# EAGLE design opi0-plus (EAGLE 9.2.1)
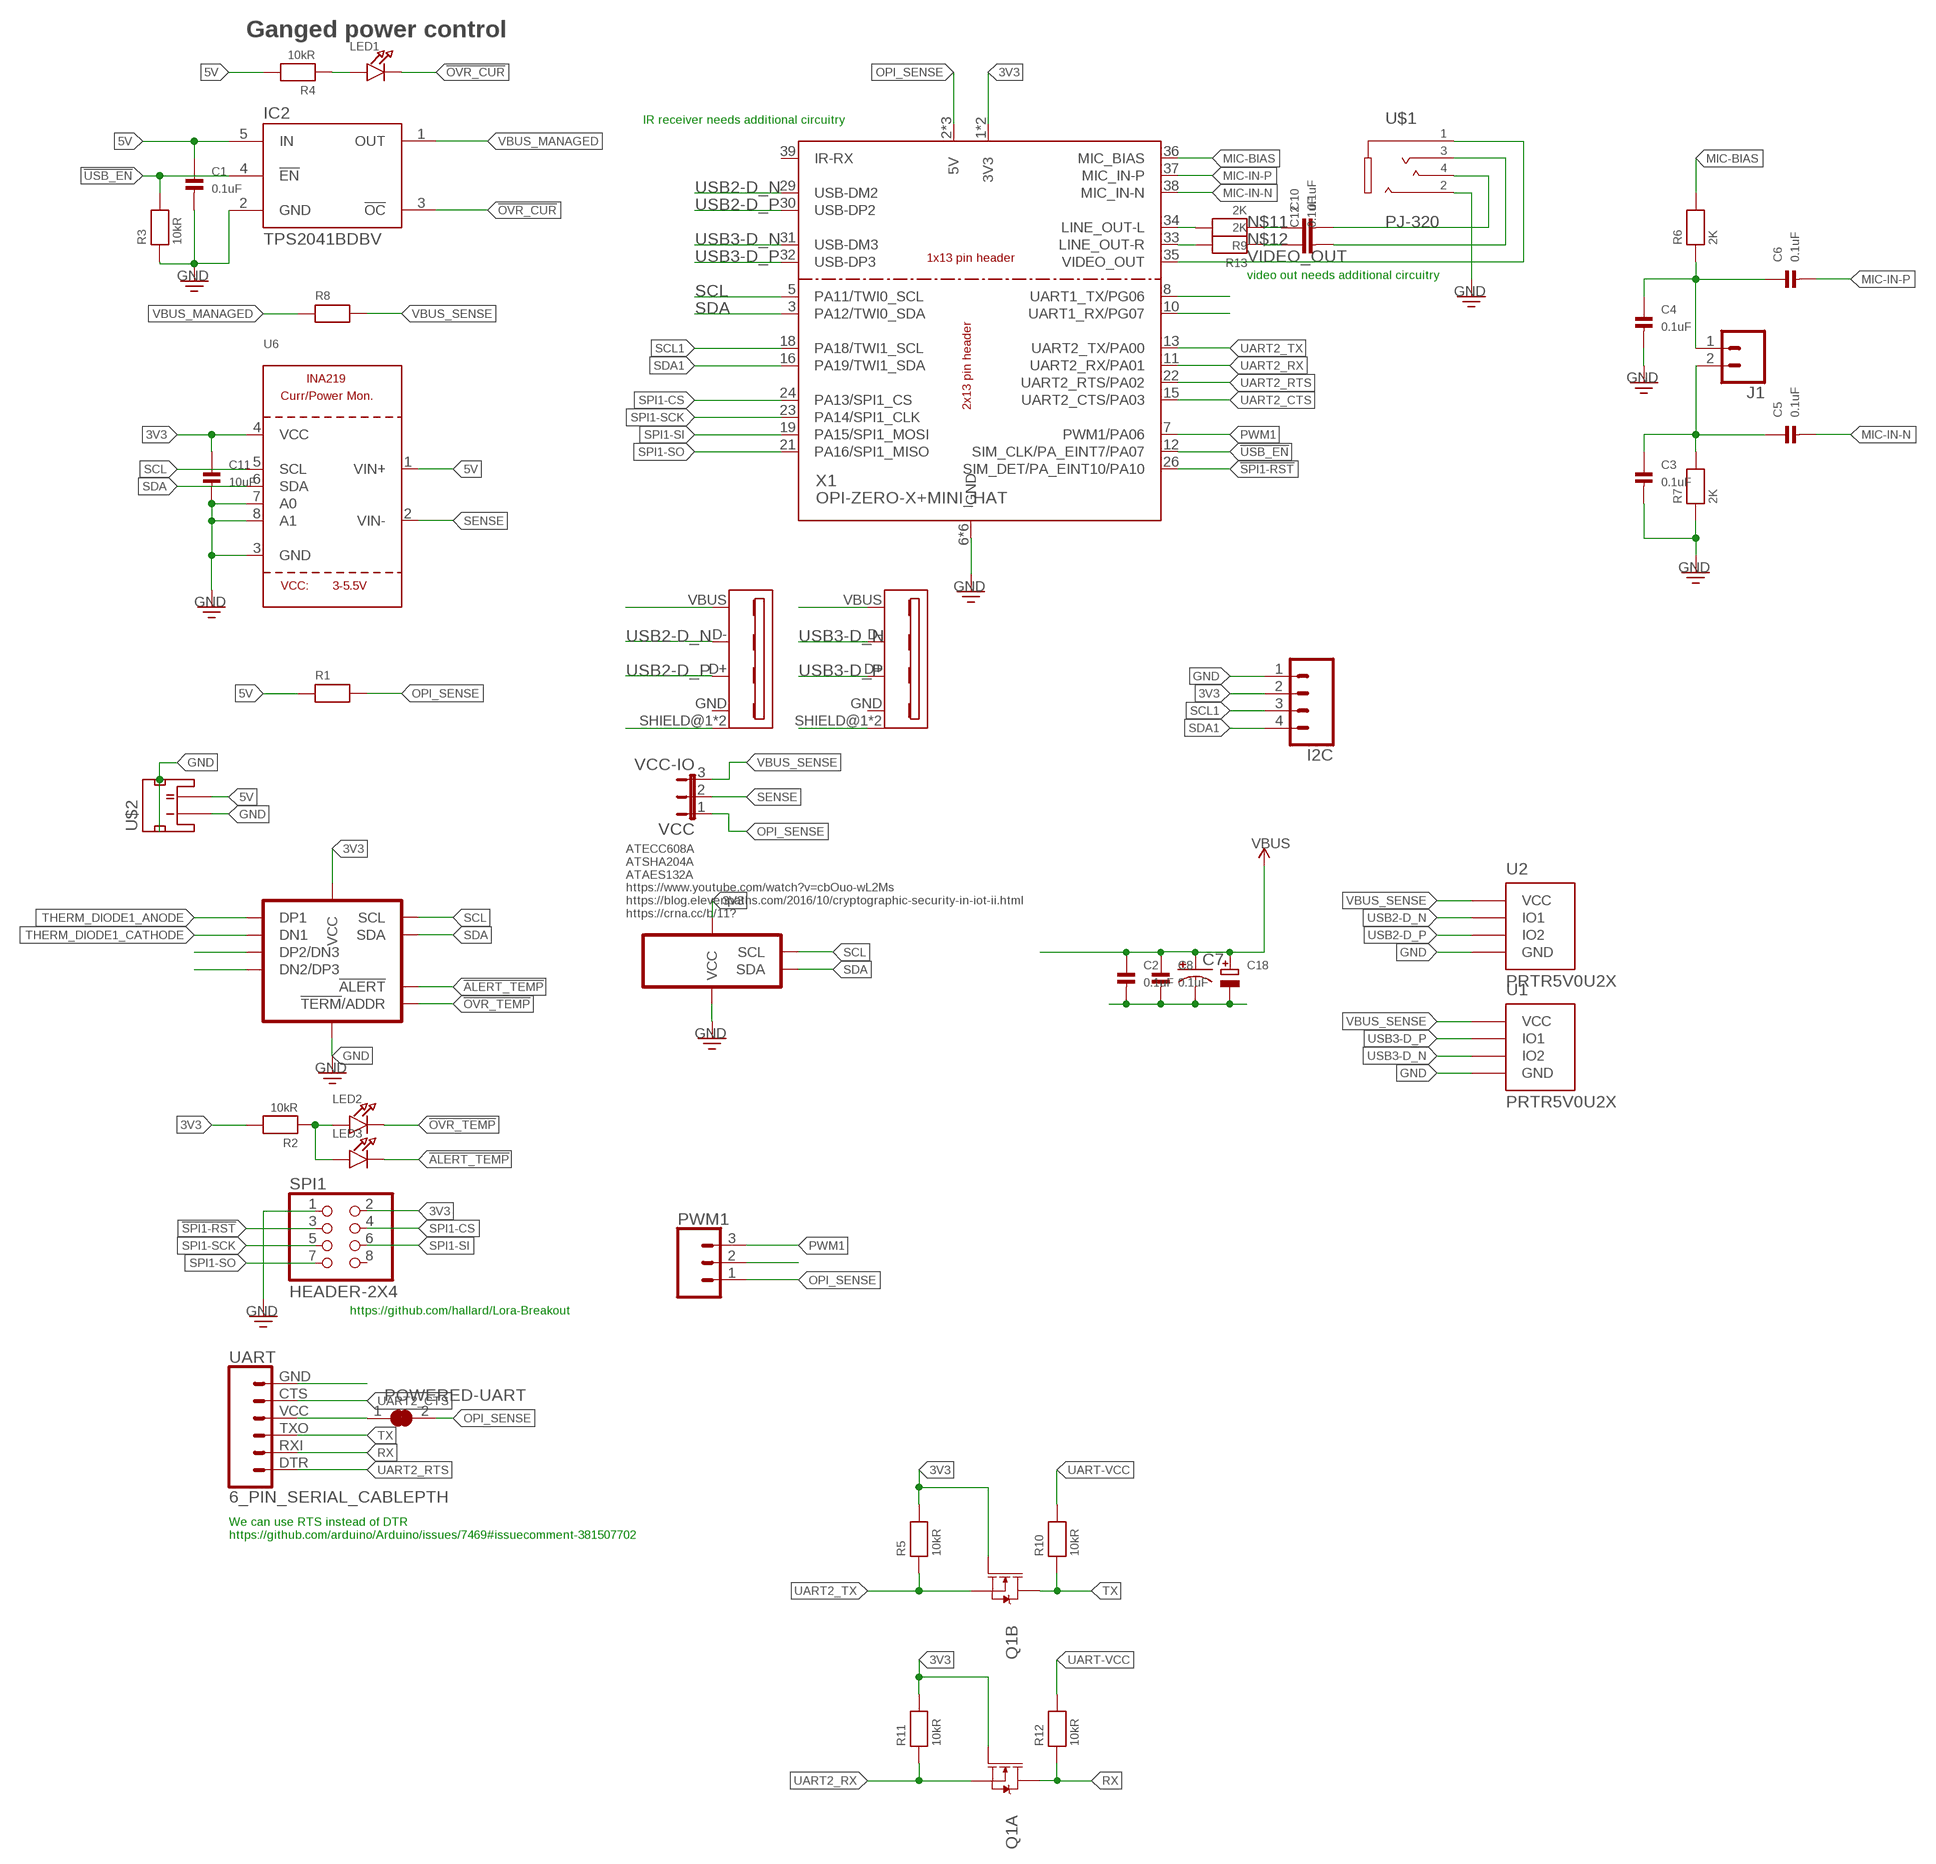
[diagram p0: schematic, sheet 1]

## Parts
C1  0.1uF  CAP_CERAMIC_0603MP  [_0603MP]
C2  0.1uF  CAP_CERAMIC_0603MP  [_0603MP]
C3  0.1uF  CAP_CERAMIC_0603MP  [_0603MP]
C4  0.1uF  CAP_CERAMIC_0603MP  [_0603MP]
C5  0.1uF  CAP_CERAMIC_0603MP  [_0603MP]
C6  0.1uF  CAP_CERAMIC_0603MP  [_0603MP]
C7  CAP_POLD  [PANASONIC_D]
C8  0.1uF  CAP_CERAMIC_0603MP  [_0603MP]
C10  0.1uF  CAP_CERAMIC_0603MP  [_0603MP]
C11  10uF  CAP_CERAMIC_0603MP  [_0603MP]
C12  0.1uF  CAP_CERAMIC_0603MP  [_0603MP]
C18  CAP_ELECTROLYTICPTH_3.5MMGRID_8MMDIA  [CELEC_3.5MM_8MM]
I2C  CONN_04  [1X04]
IC2  TPS2041BDBV  [SOT23-5L]
J1  CONN_02  [1X02]
LED1  LED0603_NOOUTLINE  [CHIPLED_0603_NOOUTLINE]
LED2  LED0603_NOOUTLINE  [CHIPLED_0603_NOOUTLINE]
LED3  LED0603_NOOUTLINE  [CHIPLED_0603_NOOUTLINE]
POWERED-UART  SOLDERJUMPER_CLOSED  [SOLDERJUMPER_CLOSEDWIRE]
PWM1  CONN_03JST-PTH-VERT  [JST-3-PTH-VERT]
Q1  MOSFET_NCH_DUAL-IRF5852  [SOT23-6]
R1  RESISTOR1206  [1206]
R2  10kR  RESISTOR_0603MP  [_0603MP]
R3  10kR  RESISTOR_0603MP  [_0603MP]
R4  10kR  RESISTOR_0603MP  [_0603MP]
R5  10kR  RESISTOR_0603MP  [_0603MP]
R6  2K  RESISTOR_0603MP  [_0603MP]
R7  2K  RESISTOR_0603MP  [_0603MP]
R8  RESISTOR1206  [1206]
R9  2K  RESISTOR_0603MP  [_0603MP]
R10  10kR  RESISTOR_0603MP  [_0603MP]
R11  10kR  RESISTOR_0603MP  [_0603MP]
R12  10kR  RESISTOR_0603MP  [_0603MP]
R13  2K  RESISTOR_0603MP  [_0603MP]
SPI1  HEADER-2X4  [2X04]
U1  PRTR5V0U2X  [SOT-143B]
U2  PRTR5V0U2X  [SOT-143B]
U6  INA219  [SOT23-8]
U$1  PJ-320  [PJ-320]
U$2  JST-PH-2P  [JST-PH-SMD]
U$3  MCP9904  [VDFN-10-0.5-3X3]
U$5  ATECC508A-MAH  [UDFN-8-0.5-3X2]
UART  6_PIN_SERIAL_CABLEPTH  [FTDI_BASIC]
USB1  USB-A-FA-F-PTH  [USB-A-F-PTH]
USB2  USB-A-FA-F-PTH  [USB-A-F-PTH]
VCC  VCC-IO  JUMPER3  [JUMPER3]
X1  OPI-ZERO-X+MINI_HAT  [OPI0+MINI_HAT]

## Nets
3V3: C11.1 I2C.2 Q1.1(A:G) Q1.3(B:G) R2.2 R5.2 R11.2 SPI1.2 U6.4(VCC) U$3.P1(VCC) U$5.P8(VCC) X1.1(3V3) X1.17(3V3)
5V: C1.1 IC2.5(IN) R1.1 R4.2 U6.1(VIN+) U$2.2
!ALERT_TEMP: LED3.C U$3.P8(!ALERT)
!OVR_CUR: IC2.3(!OC) LED1.C
!OVR_TEMP: LED2.C U$3.P7(!TERM!/ADDR)
!SPI1-RST!: SPI1.3 X1.26(SIM_DET/PA_EINT10/PA10)
!USB_EN: IC2.4(!EN) R3.2 X1.12(SIM_CLK/PA_EINT7/PA07)
GND: C1.2 C2.2 C3.2 C4.2 C7.- C8.2 C11.2 C18.- I2C.1 IC2.2(GND) PWM1.2 R3.1 R7.1 SPI1.1 U1.1(GND) U2.1(GND) U6.3(GND) U6.7(A0) U6.8(A1) U$1.2_1 U$2.1 U$2.SOL@1(PAD1) U$2.SOL@2(PAD2) U$3.P6(GND) U$5.P4(GND) UART.GND USB1.SHIELD@1(SHIELD) USB1.SHIELD@2(SHIELD) USB2.SHIELD@1(SHIELD) USB2.SHIELD@2(SHIELD) X1.6(GND) X1.9(GND) X1.14(GND) X1.20(GND) X1.25(GND) X1.28(GND)
LINE-L: C10.2 U$1.4_1
LINE-R: C12.2 U$1.3
MIC-BIAS: R6.2 X1.36(MIC_BIAS)
MIC-IN-N: C5.2 X1.38(MIC_IN-N)
MIC-IN-P: C6.2 X1.37(MIC_IN-P)
N$1: X1.8(UART1_TX/PG06)
N$2: LED2.A LED3.A R2.1
N$3: X1.10(UART1_RX/PG07)
N$4: C4.1 C6.1 J1.1 R6.1
N$5: C3.1 C5.1 J1.2 R7.2
N$6: U$3.P4(DP2/DN3)
N$7: LED1.A R4.1
N$8: R9.2 X1.34(LINE_OUT-L)
N$9: U$3.P5(DN2/DP3)
N$10: R13.2 X1.33(LINE_OUT-R)
N$11: C10.1 R9.1
N$12: C12.1 R13.1
OPI_SENSE: POWERED-UART.2 PWM1.1 R1.2 VCC.1 X1.2(5V) X1.4(5V) X1.27(5V)
PWM1: PWM1.3 X1.7(PWM1/PA06)
RX: Q1.6(A:D) R12.1 UART.RXI
SCL: U6.5(SCL) U$3.P10(SCL) U$5.P6(SCL) X1.5(PA11/TWI0_SCL)
SCL1: I2C.3 X1.18(PA18/TWI1_SCL)
SDA: U6.6(SDA) U$3.P9(SDA) U$5.P5(SDA) X1.3(PA12/TWI0_SDA)
SDA1: I2C.4 X1.16(PA19/TWI1_SDA)
SENSE: U6.2(VIN-) VCC.2
SPI1-CS: SPI1.4 X1.24(PA13/SPI1_CS)
SPI1-SCK: SPI1.5 X1.23(PA14/SPI1_CLK)
SPI1-SI: SPI1.6 X1.19(PA15/SPI1_MOSI)
SPI1-SO: SPI1.7 X1.21(PA16/SPI1_MISO)
THERM_DIODE1_ANODE: U$3.P2(DP1)
THERM_DIODE1_CATHODE: U$3.P3(DN1)
TX: Q1.4(B:D) R10.1 UART.TXO
UART2_CTS: UART.CTS X1.15(UART2_CTS/PA03)
UART2_RTS: UART.DTR X1.22(UART2_RTS/PA02)
UART2_RX: Q1.5(A:S) R11.1 X1.11(UART2_RX/PA01)
UART2_TX: Q1.2(B:S) R5.1 X1.13(UART2_TX/PA00)
UART-VCC: POWERED-UART.1 R10.2 R12.2 UART.VCC
USB2-D_N: U2.2(IO1) USB1.D- X1.29(USB-DM2)
USB2-D_P: U2.3(IO2) USB1.D+ X1.30(USB-DP2)
USB3-D_N: U1.3(IO2) USB2.D- X1.31(USB-DM3)
USB3-D_P: U1.2(IO1) USB2.D+ X1.32(USB-DP3)
VBUS_MANAGED: IC2.1(OUT) R8.1
VBUS_SENSE: C2.1 C7.+ C8.1 C18.+ R8.2 U1.4(VCC) U2.4(VCC) USB1.VBUS USB2.VBUS VCC.3
VIDEO_OUT: U$1.1 X1.35(VIDEO_OUT)
Unconnected: SPI1.8 X1.39(IR-RX)

## Notes on the sheet
- Ganged power control
- IR receiver needs additional circuitry
- video out needs additional circuitry
- ATECC608A
  ATSHA204A
  ATAES132A
  https://www.youtube.com/watch?v=cbOuo-wL2Ms
  https://blog.elevenpaths.com/2016/10/cryptographic-security-in-iot-ii.html
  https://crna.cc/b/11?
- https://github.com/hallard/Lora-Breakout
- We can use RTS instead of DTR
  https://github.com/arduino/Arduino/issues/7469#issuecomment-381507702

## Power pins joined to a net without a drawn wire
GND: USB1.GND USB2.GND

## Library data of the parts
C1-C6 C8 C10-C12 = microbuilder:CAP_CERAMIC: Ceramic Capacitors 0402 - 0402 Surface Mount Capacitors 16pF 50V 5% [Digikey: 445-4899-2-ND] 18pF 50V 5% [Digikey: 490-1281-2-ND] 22pF 50V 5% [Digikey: 490-1283-2-ND] 68pF 50V 5% [Digikey: 490-1289-2-ND] 0.1uF 10V 10% [Digikey: 490-1318-2-ND] 1.0uF 6.3V 10% [Digikey: 490-1320-2-ND] 0603 - 0603 Surface Mount Capacitors 16 pF 50V 5% [Digikey: 445-5051-2-ND] 22 pF 50V [Digikey: PCC220ACVTR-ND] 33 pF 50V 5% [Digikey: 490-1415-1-ND] 56pF 50V 5% [Digikey: 490-1421-1-ND] 220pF 50V 5% [Digikey: 445-1285-1-ND] 680 pF 50V 2200 pF 50V 5% C0G [Digikey: 445-1297-1-ND] 5600 pF 100V 5% X7R [Digikey: 478-3711-1-ND] 0.1 µF 25V 10% [Digikey: PCC2277TR-ND] 0.22 µF 16V 10% X7R [Digikey: 445-1318-1-ND] 1.0 µF 25V 10% [Digikey: 445-5146-2-ND] 0603 - RF Specific 3pF 250V +/-0.1pF RF [Digikey: 712-1347-1-ND] 18 pF 250V 5% [Digikey: 478-3505-1-ND or 712-1322-1-ND] 56 pF 250V 5% C0G RF [Digikey: 490-4867-1-ND] 68 pF 250V RF [Digikey: 490-4868-1-ND] 0805 - 0805 Surface Mount Capacitors 220 pF 250V 2% RF Ceramic Capacitor [Digikey: 712-1398-1-ND] 1000 pF 50V 2% NP0 Ceramic Capacitor [Digikey: 478-3760-1-ND] 0.1 µF 25V 10% Ceramic Capacitor [Digikey: PCC1828TR-ND] 1.0 µF 16V 10% Ceramic Capacitor[Digikey: 490-1691-2-ND] 10.0 µF 10V 10% Ceramic Capacitor[Digikey: 709-1228-1-ND] 10.0 uF 16V 10% Ceramic Capacitor [Digikey: 478-5165-2-ND] 47 uF 6.3V 20% Ceramic Capacitor [Digikey: 587-1779-1-ND or 399-5506-1-ND] 1206 - 1206 Surface Mount Capacitors 47uF 10V 20% Ceramic Capacitor [Digikey: 490-5528-1-ND or 399-5508-1-ND or 445-6010-1-ND] 100uF 6.3V -20%, +80% Y5V Ceramic Capacitor (Digikey: 490-4512-1-ND, Mouser: 81-GRM31CF50J107ZE1L)
C7 = SparkFun-Passives:CAP_POL: Capacitor Polarized These are standard SMD and PTH capacitors. Normally 10uF, 47uF, and 100uF in electrolytic and tantalum varieties. Always verify the external diameter of the through hole cap, it varies with capacity, voltage, and manufacturer. The EIA devices should be standard.
C18 = microbuilder:CAP_ELECTROLYTIC: Electrolytic Capacitors SMT PANASONIC_C - Size C Panasonic Electrolytic Aluminum Capacitor 47µF 16V 20% Electrolytic Capacitor [Digikey: PCE3890TR-ND] PANASONIC_D - Size D Panasonic Electrolytic Aluminum Capacitor 100µF 25V 20% Electrolytic Capacitor [Digikey: PCE3898TR-ND] PTH 3.5 mm grid, 8 mm diameter ... 3.5 mm grid, 10 mm diameter ...
I2C = SparkFun-Connectors:CONN_04: Multi connection point. Often used as Generic Header-pin footprint for 0.1 inch spaced/style header connections On any of the 0.1 inch spaced packages, you can populate with these: Break Away Headers - Straight <https://www.sparkfun.com/products/116> (PRT-00116) Break Away Male Headers - Right Angle <https://www.sparkfun.com/products/553> (PRT-00553) Female Headers <https://www.sparkfun.com/products/115> (PRT-00115) Break Away Headers - Machine Pin <https://www.sparkfun.com/products/117> (PRT-00117) Break Away Female Headers - Swiss Machine Pin <https://www.sparkfun.com/products/743> (PRT-00743) For SCREWTERMINALS and SPRING TERMINALS visit here: Screw Terimnals on SparkFun.com <https://www.sparkfun.com/search/results?term=Screw+Terminals> (5mm/3.5mm/2.54mm spacing) This device is also useful as a general connection point to wire up your design to another part of your project. Our various solder wires solder well into these plated through hole pads. Hook-Up Wire - Assortment (Stranded, 22 AWG) <https://www.sparkfun.com/products/11375> (PRT-11375) Hook-Up Wire - Assortment (Solid Core, 22 AWG) <https://www.sparkfun.com/products/11367> (PRT-11367) View the entire wire category on our website here <https://www.sparkfun.com/categories/141> Special notes: Molex polarized connector foot print use with SKU : PRT-08231 with associated crimp pins and housings. 1MM SMD Version SKU: PRT-10208; PROD_ID: CONN-09696
IC2 = tps204xb_205xb:TPS2041BDBV
J1 = SparkFun-Connectors:CONN_02: Multi connection point. Often used as Generic Header-pin footprint for 0.1 inch spaced/style header connections On any of the 0.1 inch spaced packages, you can populate with these: Break Away Headers - Straight <https://www.sparkfun.com/products/116> (PRT-00116) Break Away Male Headers - Right Angle <https://www.sparkfun.com/products/553> (PRT-00553) Female Headers <https://www.sparkfun.com/products/115> (PRT-00115) Break Away Headers - Machine Pin <https://www.sparkfun.com/products/117> (PRT-00117) Break Away Female Headers - Swiss Machine Pin <https://www.sparkfun.com/products/743> (PRT-00743) For SCREWTERMINALS and SPRING TERMINALS visit here: Screw Terimnals on SparkFun.com <https://www.sparkfun.com/search/results?term=Screw+Terminals> (5mm/3.5mm/2.54mm spacing) This device is also useful as a general connection point to wire up your design to another part of your project. Our various solder wires solder well into these plated through hole pads. Hook-Up Wire - Assortment (Stranded, 22 AWG) <https://www.sparkfun.com/products/11375> (PRT-11375) Hook-Up Wire - Assortment (Solid Core, 22 AWG) <https://www.sparkfun.com/products/11367> (PRT-11367) View the entire wire category on our website here <https://www.sparkfun.com/categories/141> Special notes: Molex polarized connector foot print use with: PRT-08233 with associated crimp pins and housings. 2.54_SCREWTERM for use with PRT-10571. 3.5mm Screw Terminal footprints for PRT-08084 5mm Screw Terminal footprints for use with PRT-08432
LED1-LED3 = microbuilder:LED: LED 0603 - 0603 Surface Mount Package 2mA: Green LED - Low Power (3.9mcd, 2ma, 1.7Vf) - Digikey: 475-2709-2-ND Orange LED - Low Power (9.8mcd, 2ma, 1.8Vf) - Digikey: 475-1194-2-ND Red LED - Low Power (5mcd, 2ma, 1.8Vf) - Digikey: 475-1195-2-ND Yellow LED - Low Power (7mcd, 2ma, 1.8Vf) - Digikey: 475-1196-2-ND 5mA: Blue LED - Low Power (17mcd, 5ma, 2.9Vf) - Digikey: LNJ937W8CRACT-ND 0805 - 0805 Surface Mount Package 2mA: Red LED (8.8mcd, 2mA, 1.8Vf, Clear) - Low Power [Digikey: 475-2510-1-ND] Green LED (5mcd, 2mA, 1.8Vf, Clear) - Low Power [Digikey: 475-2730-1-ND] Yellow LED (11.3mcd, 2mA, 1.8Vf, Clear) - Low Power [Digikey: 475-2555-1-ND] 20mA: Red LED (104mcd, 20mA, Diffused) - LS R976 [Digikey: 475-1278-6-ND] Red LED (12mcd, 20mA, 2.0Vf, Clear) - APT2012EC [Digikey: 754-1128-1-ND] Green LED (15mcd, 20mA, 2.2Vf, Clear) - APT2012GC [Digikey: 754-1131-1-ND] Orange LED (160mcd, 20mA, 2.1Vf, Clear) - APT2012SECK [Digikey: 754-1130-1-ND] 1206 - 1206 Surface Mount Package Green LED (26mcd, 20mA, Diffused) - LG N971 [Digikey: 475-1407-6-ND] Red LED (15mcd, 20mA, Diffused) - LH N974 [Digikey: 475-1416-6-ND]
POWERED-UART = microbuilder:SOLDERJUMPER_CLOSED: Solder Jumper - Closed These solder jumpers are closed by default CLOSEDWIRE - 10 mil trace between pads that can be cut and resoldered later CLOSEDPERM - 63 mil trace between pads for a permanent connection (used to 'bridge' two signals, a shameless hack for Eagle). Can double as a test point as well (no cream layer)
PWM1 = SparkFun-Connectors:CONN_03: Multi connection point. Often used as Generic Header-pin footprint for 0.1 inch spaced/style header connections On any of the 0.1 inch spaced packages, you can populate with these: Break Away Headers - Straight <https://www.sparkfun.com/products/116> (PRT-00116) Break Away Male Headers - Right Angle <https://www.sparkfun.com/products/553> (PRT-00553) Female Headers <https://www.sparkfun.com/products/115> (PRT-00115) Break Away Headers - Machine Pin <https://www.sparkfun.com/products/117> (PRT-00117) Break Away Female Headers - Swiss Machine Pin <https://www.sparkfun.com/products/743> (PRT-00743) Stackable Header - 3 Pin (Female, 0.1") <https://www.sparkfun.com/products/13875> (PRT-13875) For SCREWTERMINALS and SPRING TERMINALS visit here: Screw Terimnals on SparkFun.com <https://www.sparkfun.com/search/results?term=Screw+Terminals> (5mm/3.5mm/2.54mm spacing) This device is also useful as a general connection point to wire up your design to another part of your project. Our various solder wires solder well into these plated through hole pads. Hook-Up Wire - Assortment (Stranded, 22 AWG) <https://www.sparkfun.com/products/11375> (PRT-11375) Hook-Up Wire - Assortment (Solid Core, 22 AWG) <https://www.sparkfun.com/products/11367> (PRT-11367) View the entire wire category on our website here <https://www.sparkfun.com/categories/141> Special notes: Molex polarized connector foot print use with SKU : PRT-08232 with associated crimp pins and housings.; PROD_ID: CONN-13230
Q1 = SparkFun-DiscreteSemi:MOSFET_NCH_DUAL: Dual N-Channel MOSFET Asymmetrical layout IRF5852 — TSOP-6, 20VDS, 2.7A, datasheet <http://www.irf.com/product-info/datasheets/data/irf5852.pdf> Symmetrical layout FDMA1024NZ — MicroFET 2x2, 20VDS, 5A, datasheet <https://www.fairchildsemi.com/datasheets/FD/FDMA1024NZ.pdf> BSS138DW — SOT-363, 50VDS, 200mA, datasheet <https://www.diodes.com/assets/Datasheets/ds30203.pdf> BSS138PS — SOT-363, 60VDS, 320mA, datasheet <https://assets.nexperia.com/documents/data-sheet/BSS138PS.pdf> 2N7002DW — SOT-363, 60VDS, 230mA, datasheet <https://www.diodes.com/assets/Datasheets/ds30120.pdf> SparkFun Products: SparkFun Mini FET Shield <https://www.sparkfun.com/products/9627>
R1-R13 = microbuilder:RESISTOR: Resistors 0402 - 0402 Surface Mount Package 22 Ohm 1% 1/16W [Digikey: 311-22.0LRTR-ND] 33 Ohm 5% 1/16W 1.0K 5% 1/16W 1.5K 5% 1/16W 2.0K 1% 1/16W 10.0K 1% 1/16W [Digikey: 311-10.0KLRTR-ND] 10.0K 5% 1/16W [Digikey: RMCF0402JT10K0TR-ND] 12.1K 1% 1/16W [Digikey: 311-22.0LRTR-ND] 100.0K 5% 1/16W 0603 - 0603 Surface Mount Package 0 Ohm 1/10 Watt 1% Resistor 15 Ohm 1/10 Watt 1% Resistor 33 Ohm 1/10 Watt 1% Resistor 49.9 Ohm 1/10 Watt 1% Resistor 100 Ohm 1/10 Watt 1% Resistor 150 Ohm 1/10 Watt 1% Resistor 240 Ohm 1/10 Watt 1% Resistor 390 Ohm 1/10 Watt 1% Resistor 560 Ohm 1/10 Watt 1% Resistor 680 Ohm 1/10 Watt 1% Resistor 750 Ohm 1/10 Watt 1% Resistor 1.0K Ohm 1/10 Watt 1% Resistor 1.5K Ohm 1/10 Watt 1% Resistor 2.0K Ohm 1/10 Watt 1% Resistor 2.2K Ohm 1/10 Watt 1% Resistor 3.3K Ohm 1/10 Watt 1% Resistor 4.7K Ohm 1/10 Watt 1% Resistor 10.0K Ohm 1/10 Watt 1% Resistor 12.0K Ohm 1/10 Watt 1% Resistor 12.1K Ohm 1/10 Watt 1% Resistor 20.0K Ohm 1/10 Watt 1% Resistor 33.0K Ohm 1/10 Watt 1% Resistor 100.0K Ohm 1/10 Watt 1% Resistor 0805 - 0805 Surface Mount Package 0 Ohm 1/8 Watt 1% Resistor 33 Ohm 1/8 Watt 1% Resistor 100 Ohm 1/8 Watt 1% Resistor 150 Ohm 1/8 Watt 1% Resistor 200 Ohm 1/8 Watt 1% Resistor 240 Ohm 1/8 Watt 1% Resistor 330 Ohm 1/8 Watt 1% Resistor 390 Ohm 1/8 Watt 1% Resistor 470 Ohm 1/8 Watt 1% Resistor 1.0K Ohm 1/8 Watt 1% Resistor 1.5K Ohm 1/8 Watt 1% Resistor 2.0K Ohm 1/8 Watt 1% Resistor 4.7K Ohm 1/8 Watt 1% Resistor 5.1K Ohm 1/8 Watt 1% Resistor 5.6K Ohm 1/8 Watt 1% Resistor 10.0K Ohm 1/8 Watt 1% Resistor 22.0K Ohm 1/8 Watt 1% Resistor 33.0K Ohm 1/8 Watt 1% Resistor 100K Ohm 1/8 Watt 1% Resistor 1206 - 1206 Surface Mount Package 2012 - 2010 Surface Mount Package 0.11 Ohm 1/2 Watt 1% Resistor - Digikey: RHM.11UCT-ND
SPI1 = microbuilder:HEADER-2X4
U1 U2 = esd:PRTR5V0U2X?: I2C-Bus EDS Protection Ulta low capacitance double rail-to-rail ESD protection diode Documentation Datasheet <http://www.nxp.com/documents/data_sheet/PRTR5V0U2X.pdf> General Description Ultra low capacitance rail-to-rail ElectroStatic Discharge (ESD) protection diode in a small SOT143B Surface-Mounted Device (SMD) plastic package designed to protect two Hi-Speed data lines or high-frequency signal lines from the damage caused by ESD and other transients. PRTR5V0U2X incorporates two pairs of ultra low capacitance rail-to-rail diodes as well as an additional ESD protection diode to ensure signal line protection even if no supply voltage is available. Features ESD protection of two Hi-Speed data lines or high-frequency signal lines Ultra low input/output to ground capacitance: C(I/O-GND) = 1 pF ESD protection up to 8kV IEC 61000-4-2, level 4 (ESD) Very low clamping voltage due to an integrated additional ESD protection diode Very low reverse current Small SMD plastic package Applications USB 2.0 ports Digital Video Interface (DVI)/High Definition Multimedia Interface (HDMI) interfaces Mobile and cordless phones Personal Digital Assistants (PDA) Digital Cameras Wide Area Network (WAN) / Local Area Network (LAN) systems PCs, notebooks, printers, and other PC peripherals; APPLICATIONS: General Purpose; BIDIRECTIONAL_CHANNELS: 2; CAPACITANCE: 1pF @ 1MHz; CURRENT_PEAK_PULSE: -; DESCRIPTION: TVS DIODE 5.5VWM SOT143B; DOCUMENTATION_LINK: <a href="http://www.nxp.com/documents/data_sheet/PRTR5V0U2X.pdf">Datasheet</a>; DOCUMENTATION_URL: http://www.nxp.com/documents/data_sheet/PRTR5V0U2X.pdf; MANUFACTURER: NXP Semiconductors; MOUNTING_TYPE: Surface Mount; OPERATING_TEMPERATURE: -40C ~ 85C; PART_NUMBER: PRTR5V0U2X,215; POWER-PEAK_PULSE: -; POWER_LINE_PROTECTION: Yes; SUPPLIER_ITEM_LINK: <a href="http://www.digikey.com/product-detail/en/PRTR5V0U2X,215/568-4140-1-ND/1589981">Details</a>; SUPPLIER_ITEM_NUMBER: 568-4140-1-ND; SUPPLIER_ITEM_URL: http://www.digikey.com/product-detail/en/PRTR5V0U2X,215/568-4140-1-ND/1589981; SUPPLIER_LINK: <a href="http://www.digikey.com">Home Page</a>; SUPPLIER_NAME: Digi-Key; SUPPLIER_URL: http://www.digikey.com; TYPE: Steering (Rail to Rail); UNIDIRECTIONAL_CHANNELS: -; VOLTAGE_BREAKDOWN: 6V; VOLTAGE_CLAMPING: -; VOLTAGE_REVERSE: 5.5V
U6 = microbuilder:INA219: INA219 - I2C Current/Power Monitor Voltage Range: 0-26V Accuracy: 0.5% Temperature: -40°C - 125°C
U$1 = audio-plugs:PJ-320
U$2 = dc-connectors:JST-PH-2P
U$3 = ic-sensors:MCP9904
U$5 = ic-sensors:ATECC508A
UART = SparkFun-Connectors:6_PIN_SERIAL_CABLE: 6-pin header connection for use with the "FTDI BASIC" pinout - CABLE SIDE. Also known as "Arduino Serial Program Header". This is used on a design to provide a 6-pin connection point for serial communication usually from a USB cable (D+/D-) to these headers (RX/TX). It also has the remaining pins necessary for programming in the Arduino evironment (DTR, GND, and sometimes VCC). Note, this device has "CABLE" in the name. It is intended to be used on a design that usually lives on the end of your USB cable and prvides the converter chip (FTDI232 or FTDI231x) to commnicate serial RX/TX. The "sister" device, named "TARGET" is inteneded to be used on a design that contains a target micro-controller that you wish to program. You can populate with some of these: Female Headers <https://www.sparkfun.com/products/115> (PRT-00115) For reference (or to suit your programming needs) check out these designs: SparkFun FTDI Basic Breakout - 5V <https://www.sparkfun.com/products/9716> (DEV-09716) SparkFun FTDI Basic Breakout - 3.3V <https://www.sparkfun.com/products/9873> (DEV-09873) SparkFun FTDI SmartBasic <https://www.sparkfun.com/products/12935> (DEV-12935) SparkFun Beefy 3 - FTDI Basic Breakout <https://www.sparkfun.com/products/13746> (DEV-13746)
USB1 USB2 = ai_hub_usb:USB-A-F
VCC = microbuilder:JUMPER3: JUMPER - 3 Pins
X1 = OrangePi0:OPI-ZERO-X

## Net classes
0 default: width 0.152 mm, drill 0.33 mm, clearance 0.152 mm
1 power: width 3 mm

## Board
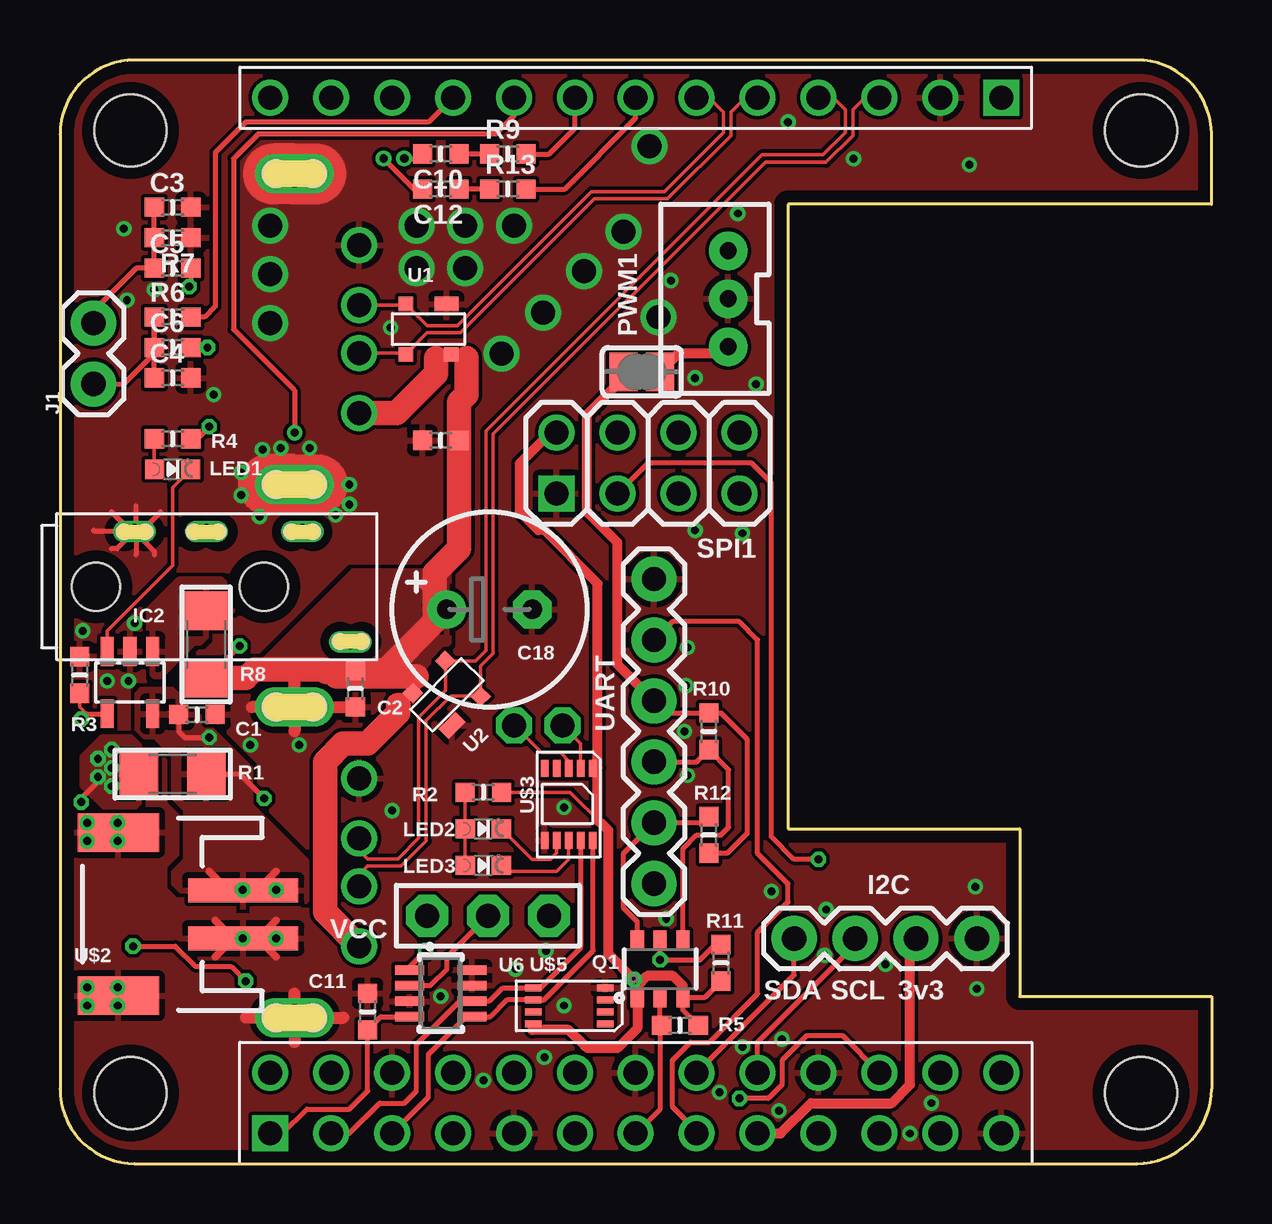
[diagram p1: board, top side]
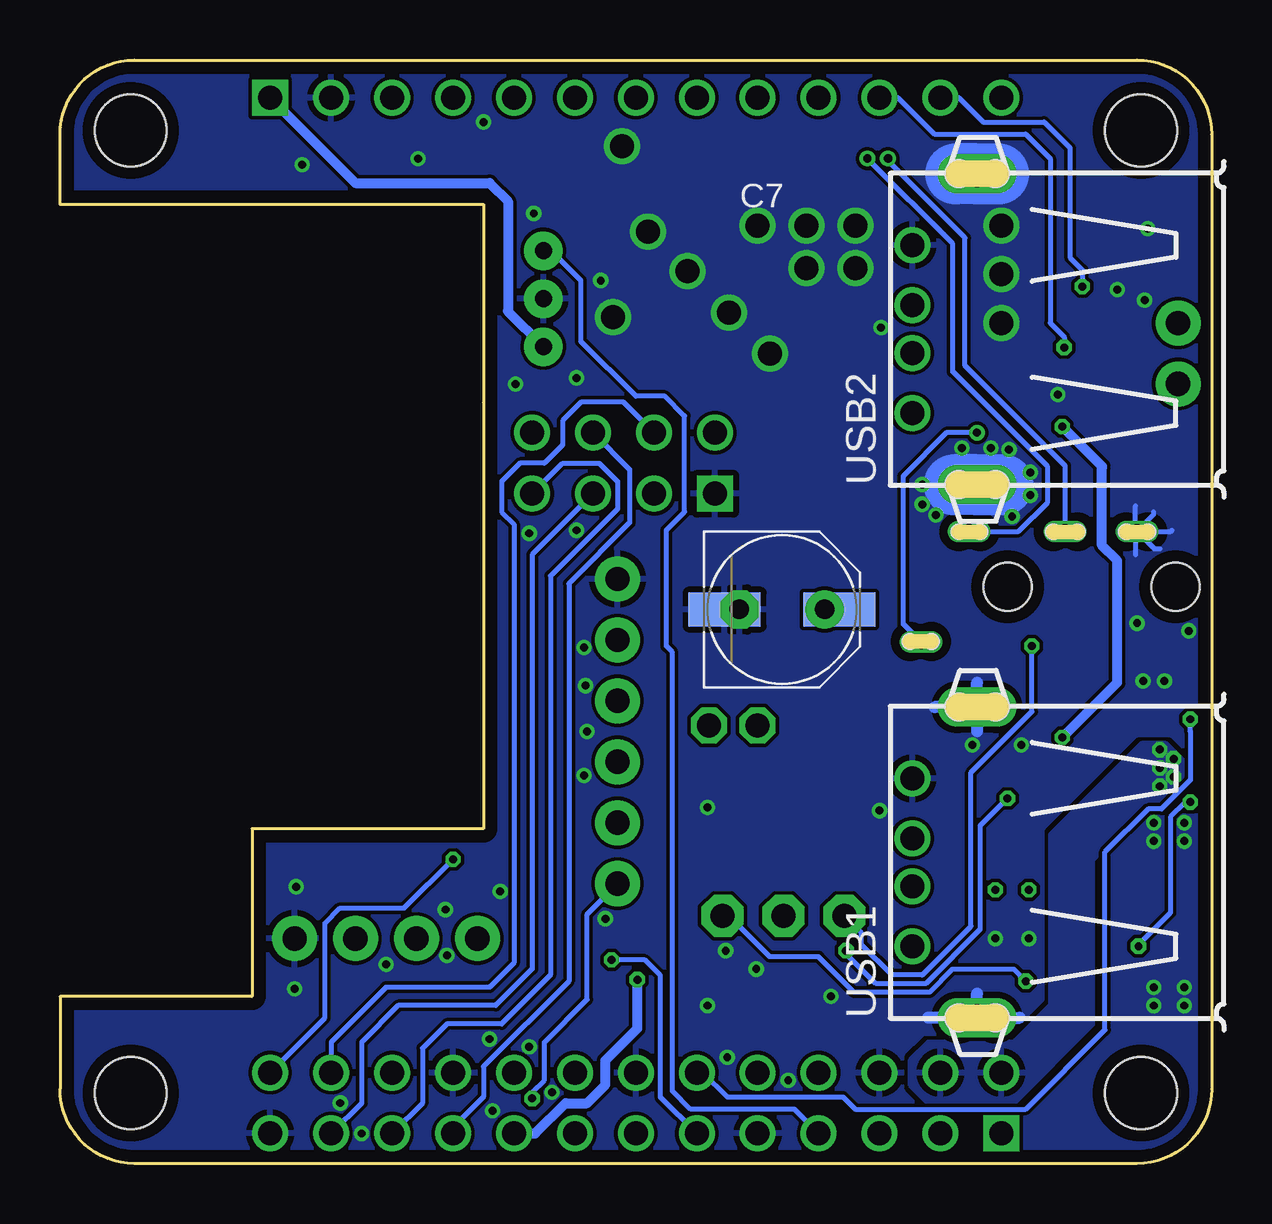
[diagram p2: board, bottom side, seen from below]

Size 48 x 46 mm. Coordinates in mm from the lower left corner, seen from the top.
Copper layers (1*16): Top 0.035mm / dielectric 1.6mm / Bottom 0.035mm
Design rules "Elecrow_2-layer_PCB_eagle_rule": minimum track width 6mil, minimum drill 12mil, track to track 6mil, track to pad 6mil, pad to pad 6mil, via to via 8mil, smd to smd 0mil, copper to edge 20mil, drill to drill 10mil, minimum pad ring 6mil, minimum via ring 6mil, stop-mask expansion 0mil, vias tented up to drill 100mil, thermal gap 10mil

### Footprints (pad centres in the part's own frame; a part is rotated, then mirrored left to right if it is on the bottom)
_0603MP = smd 0.8 x 0.8: 1 -0.762,0; 2 0.762,0
PANASONIC_D = smd 3 x 1.4: + 2.4,0; - -2.4,0
CELEC_3.5MM_8MM = drill 0.813 pad 1.6: + -1.778,0 | drill 0.813 pad 1.6 octagon: - 1.778,0
1X04 = drill 1.016 pad 1.88: 1 0,0; 2 2.54,0; 3 5.08,0; 4 7.62,0
SOT23-5L = smd 0.55 x 1.2: 1 -0.95,-1.3; 2 0,-1.3; 3 0.95,-1.3; 4 0.95,1.3; 5 -0.95,1.3
1X02 = drill 1.016 pad 1.88: 1 0,0; 2 2.54,0
CHIPLED_0603_NOOUTLINE = smd 0.8 x 0.8: A 0,-0.75; C 0,0.75
SOLDERJUMPER_CLOSEDWIRE = smd 1.168 x 1.6: 1 -0.762,0; 2 0.762,0 | smd 0.635 x 0.203: WIRE 0,0
JST-3-PTH-VERT = drill 0.7 pad 1.6: 1 -2,-0.55; 2 0,-0.55; 3 2,-0.55
SOT23-6 = smd 0.55 x 0.8: 1 -0.95,-1.2; 2 0,-1.2; 3 0.95,-1.2; 4 0.95,1.2; 5 0,1.2; 6 -0.95,1.2
1206 = smd 1.6 x 1.8: 1 -1.4,0; 2 1.4,0
2X04 = drill 1 square: 1 -3.81,-1.27 | drill 1: 2 -3.81,1.27; 3 -1.27,-1.27; 4 -1.27,1.27; 5 1.27,-1.27; 6 1.27,1.27; 7 3.81,-1.27; 8 3.81,1.27
SOT-143B = smd 1 x 0.6: 1 -0.75,-1.05 | smd 0.6 x 0.6: 2 0.95,-1.05; 3 0.95,1.05; 4 -0.95,1.05
SOT23-8 = smd 0.4 x 1.2: 1 -0.975,-1.3; 2 -0.325,-1.3; 3 0.325,-1.3; 4 0.975,-1.3; 5 0.975,1.3; 6 0.325,1.3; 7 -0.325,1.3; 8 -0.975,1.3
PJ-320 = drill 0.6 long: 1 5.25,-2.3; 2_1 -3.75,2.3; 3 -0.75,2.3; 4_1 3.25,2.3 | hole 2: -5.35,0; 1.65,0 | hole 0.6: -4.191,2.286; -3.302,2.286; -1.27,2.286; -0.254,2.286; 2.794,2.286; 3.683,2.286; 4.826,-2.286; 5.715,-2.286
JST-PH-SMD = smd 1 x 4.6: 1 -1,-3.7; 2 1,-3.7 | smd 1.6 x 3.4: SOL@1 -3.4,1.5; SOL@2 3.4,1.5
VDFN-10-0.5-3X3 = smd 0.7 x 0.3: P1 -1.5,1; P2 -1.5,0.5; P3 -1.5,0; P4 -1.5,-0.5; P5 -1.5,-1; P6 1.5,-1; P7 1.5,-0.5; P8 1.5,0; P9 1.5,0.5; P10 1.5,1
UDFN-8-0.5-3X2 = smd 0.7 x 0.3: P1 -1.524,0.762; P2 -1.524,0.262; P3 -1.524,-0.238; P4 -1.524,-0.738; P5 1.476,-0.738; P6 1.476,-0.238; P7 1.476,0.262; P8 1.476,0.762
FTDI_BASIC = drill 1.016 pad 1.88: CTS 10.16,0; DTR 0,0; GND 12.7,0; RXI 2.54,0; TXO 5.08,0; VCC 7.62,0
USB-A-F-PTH = drill 1: D+ 1,5.37; D- -1,5.37; GND 3.5,5.37; VBUS -3.5,5.37 | drill 1.1 long: SHIELD@1 -6.477,2.667; SHIELD@2 6.477,2.667 | hole 1.1: -6.477,3.429; -6.477,1.905; 6.477,3.429; 6.477,1.905
JUMPER3 = drill 1 pad 1.75 octagon: 1 -2.54,0; 2 0,0; 3 2.54,0
OPI0+MINI_HAT = drill 1 square: 1 -15.24,-21.59; 27 15.24,21.59 | drill 1: 2 -15.24,-19.05; 3 -12.7,-21.59; 4 -12.7,-19.05; 5 -10.16,-21.59; 6 -10.16,-19.05; 7 -7.62,-21.59; 8 -7.62,-19.05; 9 -5.08,-21.59; 10 -5.08,-19.05; 11 -2.54,-21.59; 12 -2.54,-19.05; 13 0,-21.59; 14 0,-19.05; 15 2.54,-21.59; 16 2.54,-19.05; 17 5.08,-21.59; 18 5.08,-19.05; 19 7.62,-21.59; 20 7.62,-19.05; 21 10.16,-21.59; 22 10.16,-19.05; 23 12.7,-21.59; 24 12.7,-19.05; 25 15.24,-21.59; 26 15.24,-19.05; 28 12.7,21.59; 29 10.16,21.59; 30 7.62,21.59; 31 5.08,21.59; 32 2.54,21.59; 33 0,21.59; 34 -2.54,21.59; 35 -5.08,21.59; 36 -7.62,21.59; 37 -10.16,21.59; 38 -12.7,21.59; 39 -15.24,21.59 | hole 3: -21.055,-19.896; 21.055,-19.896; 21.055,20.215; -21.055,20.215

### Placement (x,y rotation side)
C1  5.71,18.71 0 top
C2  12.32,19.79 270 top
C3  4.7,39.86 0 top
C4  4.7,32.75 0 top
C5  4.7,37.32 0 top
C6  4.7,34.02 0 top
C7  17.9,23.09 0 bottom
C8  15.87,30.14 180 top
C10  15.87,42.08 180 top
C11  12.82,6.33 90 top
C12  15.87,40.62 180 top
C18  17.9,23.09 0 top
I2C  38.22,9.38 180 top
IC2  2.92,20.05 180 top
J1  1.39,32.49 90 top
LED1  4.7,28.94 270 top
LED2  17.65,13.95 270 top
LED3  17.65,12.43 270 top
POWERED-UART  24.25,33 0 top
PWM1  27.3,36.05 90 top
Q1  25.02,8.11 0 top
R1  4.7,16.24 180 top
R2  17.65,15.47 0 top
R3  0.82,20.36 270 top
R4  4.7,30.21 0 top
R5  25.84,5.76 0 top
R6  4.7,35.29 0 top
R7  4.7,38.59 180 top
R8  6.09,21.63 270 top
R9  18.67,42.08 0 top
R10  27.05,18.01 90 top
R11  27.56,8.36 270 top
R12  27.05,13.7 270 top
R13  18.67,40.62 0 top
SPI1  24.51,29.19 0 top
U1  15.36,34.78 180 top
U2  16.13,19.54 45 top
U6  15.87,7.09 270 top
U$1  6.85,24.05 0 top
U$2  3.93,10.39 90 top
U$3  21.21,14.97 270 top
U$5  21.21,6.58 180 top
UART  24.76,11.66 90 top
USB1  7.11,12.55 90 bottom
USB2  7.11,34.78 90 bottom
VCC  17.84,10.33 180 top
X1  24,22.84 0 top

### Tracks (layer width: path | path; a pad name or v marks a point on that pad's centre or on a via)
3V3  (via drill 0.33)
  Top 0.152: R2.2 21.27,15.47 22.63,14.11
  Top 0.203: X1.1 9.27,1.25 10.28,2.27 12.06,2.27 12.82,3.03 C11.1 13.37,6.12 U6.4 | U$5.P8 19.68,5.77 19.68,5.57 | R11.2 26.86,6.91 Q1.3 25.97,6.4 R5.2 | U$3.P1 22.23,16.49 22.41,16.49
  Top 0.406: Q1.3 25.97,7.41 25.56,7.82 24.47,7.82 24.07,7.41 Q1.1 | 26.73,5.89 R5.2 | 27.56,7.47 R11.2 | 19.68,5.57 21.21,5.57 21.88,4.9 21.92,4.9 22.01,4.81 23.24,4.81 24.07,5.63 Q1.1 | X1.17 30.03,1.25 31.3,2.52 34.67,2.52 35.43,3.28 35.43,9.12 I2C.2 | Q1.1 24.07,7.53 v23.94,7.66 22.86,8.74 22.86,13.89 22.63,14.11 22.41,14.33 22.41,16.49 22.41,24.17 20.19,26.4 19.94,26.4 19.17,27.16 19.17,29.19 20.44,30.46 SPI1.2
  Bottom 0.406: X1.17 28.19,1.25 26.92,2.52 26.03,2.52 25.27,3.28 25.27,4.3 23.94,5.63 v23.94,7.66
5V  (via drill 0.33)
  Top 0.203: 8.51,11.41 v9.01,11.41 | v15.24,8.87 14.57,8.21 U6.1 | v8.51,15.22 7.49,16.24 R1.1 | C1.1 4.95,18.01 5.2,17.76 v6.22,17.76 | v6.22,30.71 5.71,30.21 R4.2
  Top 0.305: 6.22,12.17 7,11.39 U$2.2 8.24,11.39 9.01,12.17
  Bottom 0.203: v15.24,8.87 15.11,8.74 15.11,8.62 13.99,7.5 11.91,7.5 9.65,9.76 9.65,14.08 v8.51,15.22
  Bottom 0.406: v6.22,17.76 3.93,20.05 3.93,25.13 4.57,25.77 4.57,29 4.57,29.06 v6.22,30.71
  other vias: 7.62,11.41
  pour Top: 4.7,17 4.7,15.22 5.2,14.71 5.2,12.68 4.7,12.17 4.7,11.66 5.71,10.65 10.03,10.65 10.54,11.16 10.54,12.43 8,14.97 8,16.49 4.7,19.79 3.36,19.79 3.17,19.6 3.17,18.08 3.49,17.76 3.93,17.76
!ALERT_TEMP
  Top 0.152: LED3.C 18.65,12.17 20.7,12.17 21.21,12.68 U$3.P8
!OVR_CUR
  Top 0.152: IC2.3 1.97,22.21 4.7,24.94 4.7,28.19 LED1.C
!OVR_TEMP
  Top 0.152: U$3.P7 20.71,12.94 20.44,12.68 19.67,12.68 LED2.C
!SPI1-RST!  (via drill 0.33)
  Top 0.203: v31.62,12.68 30.6,12.68 29.65,13.63 29.65,28.37 28.83,29.19 24.51,29.19 SPI1.3
  Bottom 0.203: X1.26 36.95,6.08 36.95,10.01 36.32,10.65 33.65,10.65 v31.62,12.68
!USB_EN  (via drill 0.33)
  Top 0.152: R3.2 0.82,19.04 1.11,18.75
  Top 0.203: v0.89,18.52 1.11,18.75 IC2.4
  Bottom 0.203: X1.12 21.21,3.79 20.19,2.77 15.36,2.77 14.86,2.27 7.74,2.27 4.44,5.57 4.44,12.98 2.65,14.78 2.09,14.78 0.89,15.98 0.89,18.01 0.89,18.02 v0.89,18.52
GND  (via drill 0.33, 1)
  Top 0.203: U$1.2_1 3.17,26.41 3.17,27.41 | U$1.2_1 3.17,26.28 3.17,25.38 | U$1.2_1 1.44,26.35 1.39,26.4 | U$1.2_1 2.39,25.63 2.16,25.63 | U$1.2_1 2.97,26.35 2.16,27.16 | U$1.2_1 3.93,25.52 3.93,25.38 | U$1.2_1 3.38,26.35 4.19,27.16 | USB2.SHIELD@1 8,28.3 v7.55,27.86
  Top 0.305: U$2.1 9,9.39 v9.01,9.38 | U$2.1 8.24,9.39 9.01,8.62 | U$2.1 8.27,9.39 9.01,10.14 | U$2.1 7.22,9.39 6.47,10.14 | U$2.1 7.25,9.39 6.47,8.62
  Top 0.508: USB1.SHIELD@1 9.78,5.06 | USB1.SHIELD@1 9.78,7.09 | USB1.SHIELD@1 11.81,6.08 | USB1.SHIELD@1 7.74,6.08 | USB1.SHIELD@2 9.78,18.01 | USB1.SHIELD@2 9.78,20.05 | USB1.SHIELD@2 8,19.03 | USB1.SHIELD@2 C2.2
  Top 2.54: 10.66,41.26 USB2.SHIELD@2 8.89,41.26 | 8.7,28.3 USB2.SHIELD@1 10.73,28.3
  Bottom 0.203: U$1.2_1 3.17,26.28 3.17,25.38 | U$1.2_1 3.17,26.41 3.17,27.41 | U$1.2_1 2.41,27.04 2.41,27.16 | U$1.2_1 1.7,26.35 1.65,26.4 | U$1.2_1 2.39,25.63 2.16,25.63
  Bottom 0.508: USB1.SHIELD@2 9.78,20.05 | USB1.SHIELD@2 11.55,19.03 | USB1.SHIELD@2 9.78,18.01 | USB1.SHIELD@1 11.81,6.08 | USB1.SHIELD@1 8,6.08 | USB1.SHIELD@1 9.78,7.09
  Bottom 2.54: 10.73,28.3 USB2.SHIELD@1 8.7,28.3 | 10.66,41.26 USB2.SHIELD@2 8.89,41.26
  other vias: 30.35,43.41 21.84,37.19 23.49,38.84 16.89,39.1 20.13,35.48 16.89,37.32 24.57,42.4 18.41,33.76 14.86,39.1 33.08,41.89 13.84,14.71 0.95,22.21 1.97,20.11 2.85,20.11 28.44,26.27 18.92,39.1 14.86,37.32 7.62,9.38 1.14,7.35 1.14,6.58 2.41,6.58 2.41,7.35 2.41,13.44 1.14,13.44 1.14,14.2 2.41,14.2 7.93,17.44 3.11,22.52 9.97,17.44 26.48,26.4 35.43,1.25 36.32,2.52 31.87,8.68 30.1,5.19 26.03,18.01 26.16,21.51 26.16,16.17 26.1,19.92 18.98,8.11 20.25,8.87 21.02,6.58 29.97,2.2 27.49,2.96 28.44,4.87 37.91,41.64 29.02,32.49 26.48,32.75 25.46,36.81 28.25,39.6 8.44,29.76 9.2,29.83 10.41,29.83 12.06,28.3 12.06,27.48 11.49,27.03 7.55,28.81 8.32,26.97 24.95,35.29 29.65,11.35 31.94,10.58 34.41,8.3 38.16,11.54 38.22,7.28 25.27,10.2 21.02,14.84 15.87,6.97 17.65,3.47 20.19,4.43 8.76,39.1 8.76,37.06 8.76,35.03 6.41,32.05 2.79,35.98 3.93,36.43 2.66,38.97 13.78,34.84
  pour Bottom (rank 5): -1.4,46.97 -1.4,-1.29 50.67,-1.29 50.67,46.97
  pour Top (rank 5): -2.67,48.24 -2.67,-0.02 -2.67,-2.56 49.4,-2.56 49.4,48.24
LINE-L  (via drill 0.35)
  Top 0.203: v14.35,41.89 14.92,41.89 C10.2
  Bottom 0.203: U$1.4_1 8.05,26.35 6.85,27.54 6.85,29.06 10.79,33 10.79,38.33 v14.35,41.89
LINE-R  (via drill 0.35)
  Top 0.203: v13.49,41.89 14.76,40.62 C12.2
  Bottom 0.203: U$1.3 6.1,29.08 10.28,33.25 10.28,38.59 13.59,41.89 v13.49,41.89
MIC-BIAS
  Top 0.203: X1.36 15.36,43.41 7.74,43.41 6.47,42.14 6.47,35.73 6.03,35.29 R6.2
MIC-IN-N  (via drill 0.33)
  Top 0.203: C5.2 5.46,36.63 v5.38,36.56
  Bottom 0.203: X1.38 10.54,44.43 9.52,43.41 6.98,43.41 5.9,42.34 5.9,37.76 5.38,37.25 v5.38,36.56
MIC-IN-P  (via drill 0.33)
  Top 0.203: C6.2 v6.15,34.02
  Bottom 0.203: X1.37 13.08,44.43 11.55,42.91 7.74,42.91 6.73,41.89 6.73,35.03 6.15,34.45 v6.15,34.02
N$2
  Top 0.152: LED2.A 16.89,13.96 | 16.89,13.96 R2.1 | LED3.A 16.89,12.44 16.89,13.96
N$4
  Top 0.203: J1.1 2.66,32.49 3.93,33.76 R6.1 C6.1 C4.1
N$5
  Top 0.203: J1.2 1.39,35.54 3.17,37.32 C5.1 R7.2 C3.1
N$7
  Top 0.152: LED1.A 3.93,28.95 R4.1
N$8
  Top 0.203: R9.2 20.38,42.08 21.46,43.16 X1.34
N$10
  Top 0.203: R13.2 21.04,40.62 24,43.58 X1.33
N$11
  Top 0.203: R9.1 C10.1
N$12
  Top 0.203: R13.1 C12.1
OPI_SENSE  (via drill 0.33)
  Top 0.203: v1.58,16.11 1.58,15.92 0.89,15.22 v0.89,15.06 | v3.04,9.06 4.81,9.06 5.66,8.21 7.13,8.21 v7.74,7.6
  Top 0.406: PWM1.1 27.57,33.76 25.78,33.76 POWERED-UART.2
  Bottom 0.203: v0.89,15.06 0.92,15.03 1.12,15.03 1.71,14.44 1.71,10.46 3.04,9.12 v3.04,9.06 | v7.74,7.6 8.25,8.11 10.8,8.11 11.76,7.14 14.91,7.14 16.38,8.62 18.41,8.62 20.13,10.33 VCC.1
  Bottom 0.406: X1.27 35.68,40.87 30.1,40.87 29.33,40.11 29.33,35.54 29.34,35.54 PWM1.1
  other vias: 1.58,16.87 2.16,17.25 2.16,16.49 2.16,15.73
  pour Bottom: 1.14,15.73 1.14,16.74 1.9,17.51 2.92,17.51 6.73,13.7 6.73,6.58 8.25,5.06 11.81,5.06 12.57,4.3 12.57,3.28 11.81,2.52 8.25,2.52 4.95,5.82 4.95,12.68 2.66,14.97 1.9,14.97
  pour Top: 0.89,17 1.71,17.82 2.98,17.82 3.93,16.87 3.93,15.6 3.04,14.71 1.9,14.71 0.89,15.73
PWM1
  Bottom 0.203: X1.7 17.4,2.27 21.71,2.27 22.48,3.03 22.48,21.32 22.73,21.57 22.73,26.4 21.97,27.16 21.97,31.16 22.79,31.98 24,31.98 26.29,34.27 26.29,36.81 27.52,38.05 PWM1.3
RX
  Top 0.203: Q1.6 24.07,10.07 23.49,10.65 23.49,12.93 UART.RXI 26.79,14.2 R12.1
SCL
  Top 0.203: X1.5 15.36,2.77 15.36,4.55 16.93,6.12 U6.5 | U6.5 17.2,6.09 | U6.5 17.94,6.12 18.67,6.84 19.71,6.84 U$5.P6 20.17,6.82 22.22,8.87 22.22,13.45 U$3.P10
SCL1
  Top 0.203: X1.18 29.08,5.06 33.14,9.12 I2C.3
SDA
  Top 0.203: X1.3 12.06,1.25 13.33,2.52 14.35,2.52 14.86,3.03 14.86,4.96 16.66,6.77 17.01,6.77 | 17.01,6.77 U6.6 | 17.01,6.77 17.02,6.77 17.9,6.77 18.45,7.32 U$5.P5 20.03,7.32 21.71,9 21.71,13.46 U$3.P9
SDA1
  Top 0.203: X1.16 30.6,7.85 I2C.4
SENSE
  Top 0.203: U6.2 15.43,7.42 16.13,8.11 16.13,8.62 VCC.2
SPI1-CS
  Bottom 0.203: SPI1.4 24.51,31.73 26.29,31.73 27.05,30.97 27.05,29.95 27.81,29.19 28.83,29.19 29.59,28.43 29.59,27.16 29.08,26.65 29.08,8.36 30.1,7.35 34.41,7.35 36.7,5.06 X1.24
SPI1-SCK
  Bottom 0.203: SPI1.5 28.32,25.38 28.32,8.11 29.84,6.58 33.91,6.58 35.43,5.06 35.43,2.52 X1.23
SPI1-SI
  Bottom 0.203: SPI1.6 24.25,28.94 24.25,26.71 26.79,24.17 26.79,7.6 30.35,4.04 30.35,2.77 31.62,1.5 X1.19
SPI1-SO
  Bottom 0.203: SPI1.7 27.05,29.19 25.52,29.19 24.76,28.43 24.76,27.29 27.56,24.49 27.56,7.85 29.59,5.82 31.87,5.82 32.89,4.81 32.89,2.52 X1.21
THERM_DIODE1_ANODE  (via drill 1)
  Top 0.152: U$3.P2 21.71,17.51 v20.95,18.27
THERM_DIODE1_CATHODE  (via drill 1)
  Top 0.152: v18.92,18.27 20.06,17.13 20.87,17.13 21.21,16.79 U$3.P3
TX
  Top 0.203: UART.TXO 26.54,16.74 R10.1 27.87,16.43 27.87,14.01 27.56,13.7 26.54,13.7 25.97,13.12 Q1.4
UART2_CTS
  Top 0.203: X1.15 26.54,1.35 25.54,2.36 25.54,4.29 25.52,4.3 26.29,5.06 27.06,5.06 29.08,7.08 29.08,9.63 30.35,10.9 30.35,11.66 29.08,12.93 29.08,21.82 28.32,22.59 25.52,22.59 UART.CTS
UART2_RTS  (via drill 0.33)
  Top 0.203: X1.22 32.64,5.31 31.11,5.31 30.1,4.3 30.1,3.28 29.52,2.71 v28.32,2.71
  Bottom 0.203: v28.32,2.71 28.32,2.97 27.81,3.47 27.81,5.06 26.03,6.84 26.03,10.39 UART.DTR
UART2_RX  (via drill 0.33)
  Top 0.203: Q1.5 v25.02,8.49 26.67,8.49 27.3,9.12 R11.1
  Bottom 0.203: v25.02,8.49 23.62,8.49 22.98,7.85 22.98,2.77 X1.11
UART2_TX
  Top 0.203: X1.13 25.02,2.27 25.02,5.7 R5.1 25.02,5.82 Q1.2
UART-VCC
  Top 0.203: UART.VCC 25.27,18.78 R10.2 27.56,18.78 28.63,17.7 28.63,13.76 27.81,12.93 R12.2
  Top 0.406: UART.VCC 23.24,20.81 23.24,25.89 21.97,27.16 21.97,31.22 23.49,32.75 POWERED-UART.1
USB2-D_N
  Top 0.152: X1.29 33.55,44.43 33.04,43.92 33.04,42.84 31.94,41.74 29.4,41.74 18.06,30.4 18.06,21.25 17.54,20.74 U2.2 17.51,19.49 16.3,19.49 15.26,18.46 15.26,13.44 14.22,12.4 12.82,12.4 12.48,12.06 USB1.D-
USB2-D_P
  Top 0.152: X1.30 32.23,44.43 32.74,43.92 32.74,42.97 31.81,42.04 29.27,42.04 17.75,30.52 17.75,21.38 17.32,20.95 U2.3 16.08,20.93 16.08,19.71 14.96,18.59 14.96,13.57 14.09,12.71 12.82,12.71 12.48,13.05 USB1.D+
USB3-D_N
  Top 0.152: X1.31 28.57,44.43 27.96,43.82 27.96,42.84 25.33,40.21 22.28,40.21 16.7,34.63 15.31,34.63 14.52,33.84 14.46,33.78 | 14.35,33.79 U1.3 14.46,33.78 | USB2.D- 14.46,33.78
USB3-D_P
  Top 0.152: X1.32 27.05,44.43 27.66,43.82 27.66,42.97 25.21,40.52 22.16,40.52 16.57,34.93 15.31,34.93 U1.2 | U1.2 14.35,35.76 | 14.41,35.76 U1.2 | U1.2 14.36,35.78 USB2.D+
VBUS_MANAGED
  pour Top: 3.93,20.3 4.19,20.3 5.58,21.7 5.84,21.7 7.24,23.09 7.24,23.86 6.73,24.36 4.95,24.36 3.68,23.09 3.68,20.55
VBUS_SENSE  (via drill 0.33)
  Top 0.203: v7.49,21.57 6.15,20.23 R8.2
  Top 0.305: 14.86,20.3 14.86,19.75 U2.4 14.61,19.61 14.11,19.12 | 15.68,33.57 15.84,33.73 U1.4 16.79,33.73 16.95,33.57 | 15.11,24.11 C18.+ 15.11,22.08
  Top 0.813: 10.98,20.6 11.09,20.49
  Top 1.016: USB1.VBUS 11.05,10.49 11.05,16.74 11.81,17.51 12.82,17.51 14.09,18.78 14.09,19.12 14.11,19.12 | R8.2 7.75,20.23 8.11,20.6 | 8.11,20.6 10.98,20.6 | 11.09,20.49 11.33,20.49 11.53,20.3 14.86,20.3 | 8.11,20.6 13.59,20.55 15.62,22.59 15.62,24.62 16.63,25.63 C8.1 16.63,31.73 16.95,32.05 16.95,33.57 | USB2.VBUS 14.02,31.28 15.68,32.94 15.68,33.57
  Bottom 0.203: v7.49,21.57 7.49,18.84 10.03,16.3 10.03,9.89 12.06,7.85 13.33,7.85 14.6,9.12 14.6,9.63 VCC.3 | C7.+ C18.+
  pour Top: 8.51,21.06 12.19,24.75 16.25,24.75 16.25,21.7 14.86,20.3 8.76,20.3 8.51,20.55
VIDEO_OUT  (via drill 0.33)
  Top 0.203: X1.35 18.92,43.67 18.16,42.91 8.25,42.91 7.24,41.89 7.24,34.78 9.78,32.24 v9.78,30.46
  Bottom 0.203: v9.78,30.46 11.05,30.46 12.87,28.64 12.87,22.51 U$1.1

### Text on the board
tNames: SDA | SCL | 3v3
tValues: S2B-PH-SM4-TB